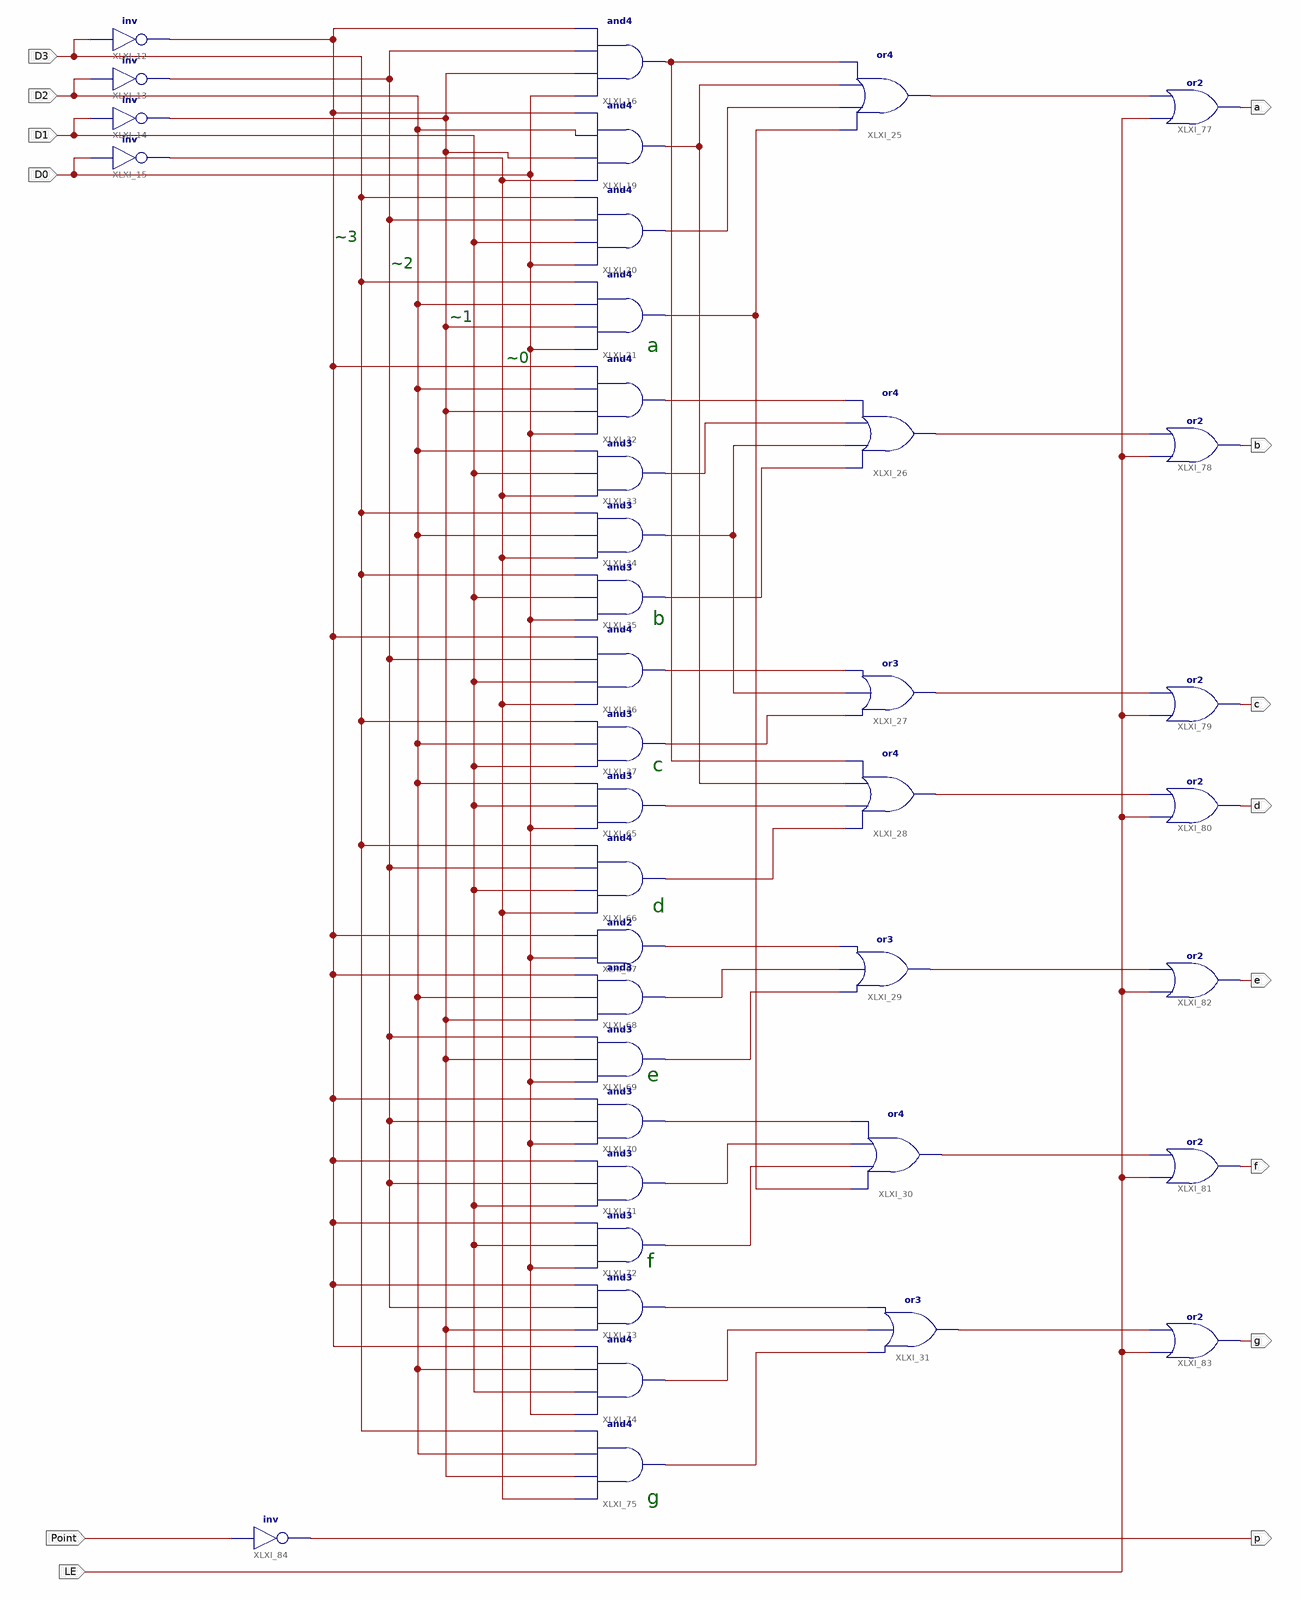
[diagram p0: schematic sheet 1]
// Xilinx ISE schematic MC14495_ZJU.sch (kintex7) as structural Verilog: 40 symbols, 14 ports
module MC14495_ZJU (
  input  D3,
  input  D2,
  input  D0,
  input  LE,
  input  D1,
  input  Point,
  output a,
  output b,
  output c,
  output d,
  output e,
  output f,
  output g,
  output p
);

  wire XLXN_3, XLXN_6, XLXN_12, XLXN_14, XLXN_15, XLXN_20, XLXN_21, XLXN_22, XLXN_26, XLXN_28, XLXN_32,
       XLXN_36, XLXN_38, XLXN_50, XLXN_51, XLXN_52, XLXN_54, XLXN_56, XLXN_57, XLXN_59, XLXN_60, XLXN_61,
       XLXN_62, XLXN_74, XLXN_81, XLXN_82, XLXN_83, XLXN_84, XLXN_85, XLXN_86, XLXN_87, XLXN_127;

  not XLXI_12 (XLXN_3, D3);
  not XLXI_13 (XLXN_6, D2);
  not XLXI_14 (XLXN_127, D1);
  not XLXI_15 (XLXN_12, D0);
  and XLXI_16 (XLXN_38, D0, XLXN_127, XLXN_6, XLXN_3);
  and XLXI_19 (XLXN_14, XLXN_12, XLXN_127, D2, XLXN_3);
  and XLXI_20 (XLXN_15, D0, D1, XLXN_6, D3);
  and XLXI_21 (XLXN_56, D0, XLXN_127, D2, D3);
  and XLXI_32 (XLXN_20, D0, XLXN_127, D2, XLXN_3);
  and XLXI_33 (XLXN_21, XLXN_12, D1, D2);
  and XLXI_34 (XLXN_22, XLXN_12, D2, D3);
  and XLXI_35 (XLXN_26, D0, D1, D3);
  and XLXI_36 (XLXN_28, XLXN_12, D1, XLXN_6, XLXN_3);
  and XLXI_37 (XLXN_32, D1, D2, D3);
  or XLXI_25 (XLXN_81, XLXN_56, XLXN_15, XLXN_14, XLXN_38);
  or XLXI_26 (XLXN_82, XLXN_26, XLXN_22, XLXN_21, XLXN_20);
  or XLXI_27 (XLXN_83, XLXN_32, XLXN_22, XLXN_28);
  or XLXI_31 (XLXN_87, XLXN_74, XLXN_62, XLXN_61);
  or XLXI_29 (XLXN_86, XLXN_54, XLXN_52, XLXN_51);
  or XLXI_30 (XLXN_85, XLXN_56, XLXN_60, XLXN_59, XLXN_57);
  or XLXI_28 (XLXN_84, XLXN_50, XLXN_36, XLXN_14, XLXN_38);
  and XLXI_65 (XLXN_36, D0, D1, D2);
  and XLXI_66 (XLXN_50, XLXN_12, D1, XLXN_6, D3);
  and XLXI_67 (XLXN_51, D0, XLXN_3);
  and XLXI_68 (XLXN_52, XLXN_127, D2, XLXN_3);
  and XLXI_69 (XLXN_54, D0, XLXN_127, XLXN_6);
  and XLXI_70 (XLXN_57, D0, XLXN_6, XLXN_3);
  and XLXI_71 (XLXN_59, D1, XLXN_6, XLXN_3);
  and XLXI_72 (XLXN_60, D0, D1, XLXN_3);
  and XLXI_73 (XLXN_61, XLXN_127, XLXN_6, XLXN_3);
  and XLXI_74 (XLXN_62, D0, D1, D2, XLXN_3);
  and XLXI_75 (XLXN_74, XLXN_12, XLXN_127, D2, D3);
  or XLXI_83 (g, LE, XLXN_87);
  or XLXI_82 (e, LE, XLXN_86);
  or XLXI_81 (f, LE, XLXN_85);
  or XLXI_80 (d, LE, XLXN_84);
  or XLXI_79 (c, LE, XLXN_83);
  or XLXI_78 (b, LE, XLXN_82);
  or XLXI_77 (a, LE, XLXN_81);
  not XLXI_84 (p, Point);

  // Notes on the sheet:
  //   ~3
  //   ~2
  //   ~1
  //   a
  //   ~0
  //   b
  //   c
  //   d
  //   e
  //   f
  //   g
endmodule
